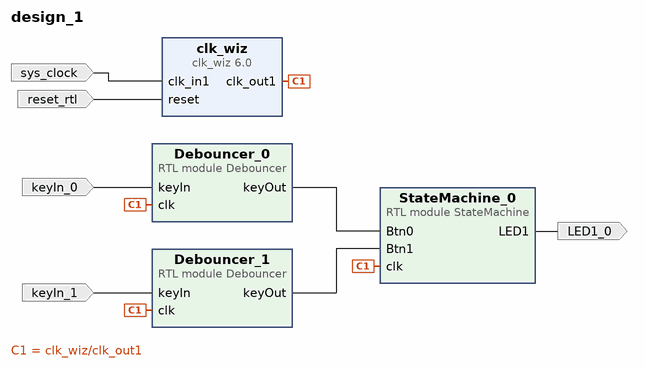
[diagram p0: block diagram of the top level]
# Vivado block design design_1, xc7z020clg400-1, Vivado 2019.2
create_bd_design design_1

create_bd_port -dir O LED1_0
create_bd_port -dir I keyIn_0
create_bd_port -dir I keyIn_1
create_bd_port -dir I -type clk sys_clock
set_property -dict {CONFIG.FREQ_HZ 125000000 CONFIG.PHASE 0.000} [get_bd_ports sys_clock]
create_bd_port -dir I -type rst reset_rtl
set_property -dict {CONFIG.POLARITY ACTIVE_HIGH} [get_bd_ports reset_rtl]

create_bd_cell -type ip -vlnv xilinx.com:ip:clk_wiz:6.0 clk_wiz
set_property -dict {CONFIG.CLK_IN1_BOARD_INTERFACE sys_clock CONFIG.USE_BOARD_FLOW true} [get_bd_cells clk_wiz]
create_bd_cell -type module -reference StateMachine StateMachine_0
create_bd_cell -type module -reference Debouncer Debouncer_0
set_property -dict {CONFIG.delay 70} [get_bd_cells Debouncer_0]
create_bd_cell -type module -reference Debouncer Debouncer_1
set_property -dict {CONFIG.delay 70} [get_bd_cells Debouncer_1]

# ---- connections ----

connect_bd_net [get_bd_pins clk_wiz/clk_out1] [get_bd_pins StateMachine_0/clk] [get_bd_pins Debouncer_0/clk] [get_bd_pins Debouncer_1/clk]
connect_bd_net [get_bd_pins Debouncer_0/keyOut] [get_bd_pins StateMachine_0/Btn0]
connect_bd_net [get_bd_pins StateMachine_0/LED1] [get_bd_ports LED1_0]
connect_bd_net [get_bd_pins Debouncer_1/keyOut] [get_bd_pins StateMachine_0/Btn1]
connect_bd_net -net keyIn_0_1 [get_bd_ports keyIn_0] [get_bd_pins Debouncer_0/keyIn]
connect_bd_net -net keyIn_1_1 [get_bd_ports keyIn_1] [get_bd_pins Debouncer_1/keyIn]
connect_bd_net [get_bd_ports sys_clock] [get_bd_pins clk_wiz/clk_in1]
connect_bd_net [get_bd_ports reset_rtl] [get_bd_pins clk_wiz/reset]

validate_bd_design
save_bd_design
